# Altium schematic sheet Oscillator.SchDoc
size A4; SheetNumber: 1; SheetTotal: 1
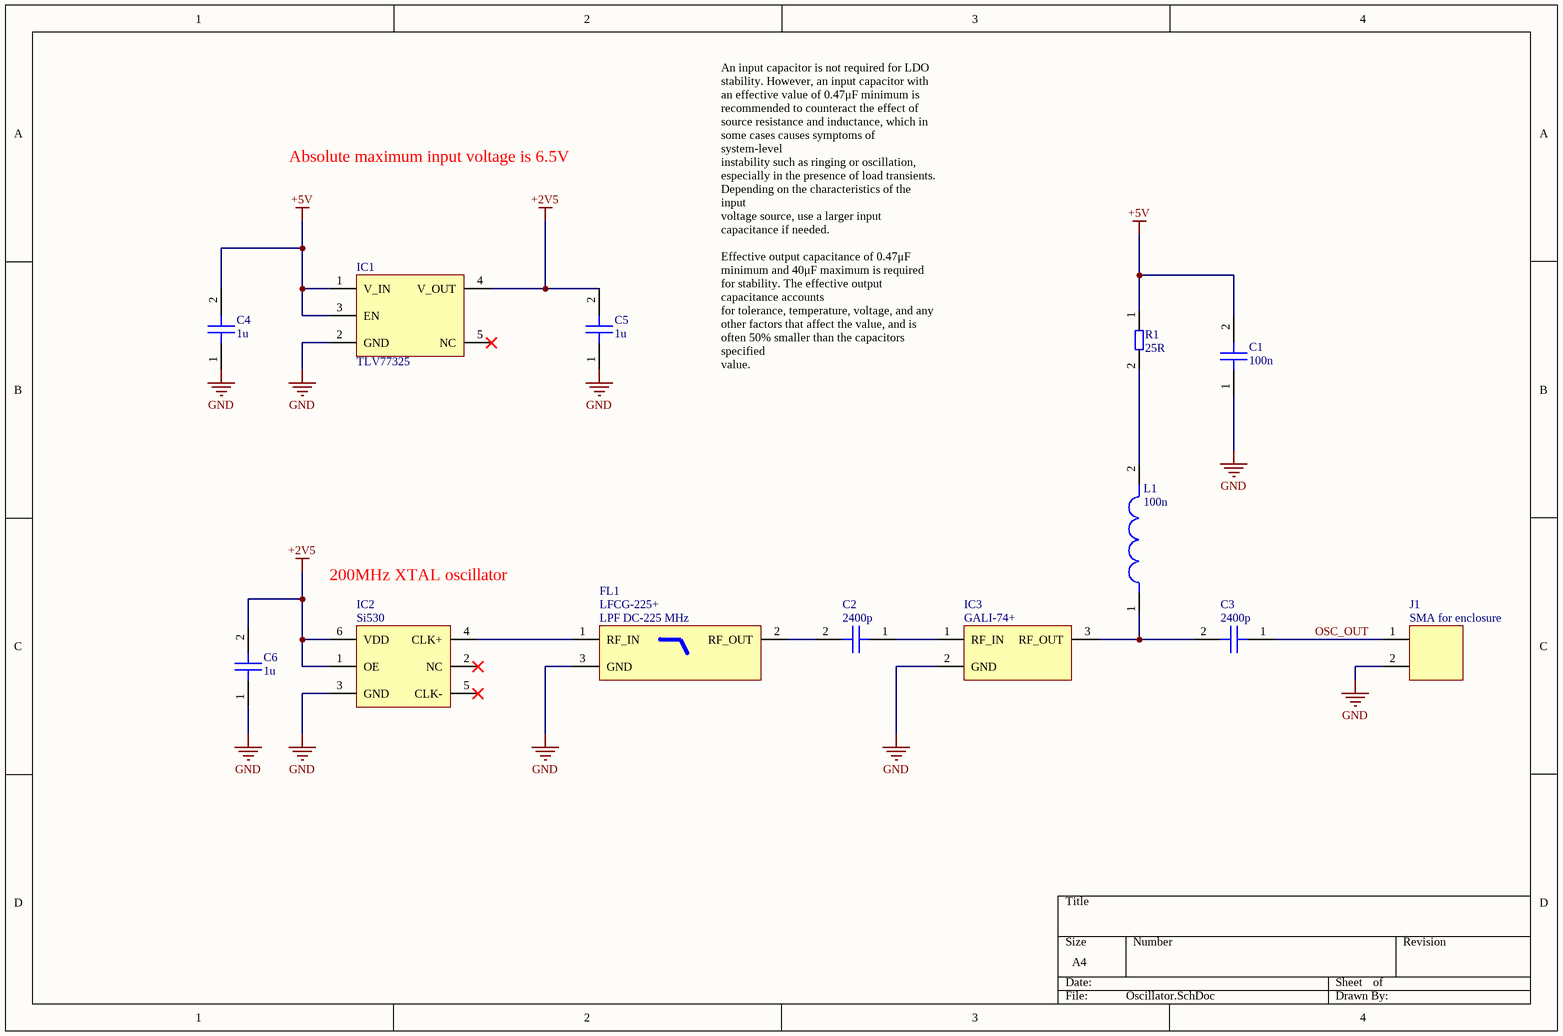
[diagram p0: Oscillator.SchDoc]

## Parts
C1  100n  [0603_CAP]
C2  2400p  [0603_CAP]
C3  2400p  [0603_CAP]
C4  1u  [0603_CAP]
C5  1u  [0603_CAP]
C6  1u  [0603_CAP]
FL1  LFCG-225+
IC1  TLV77325  [IC_TLV77325PDBVR_TEXAS_INSTRUMENTS]
IC2  Si530  [IC_530FC200M000DG]
IC3  GALI-74+  [IC_GALI74+_MINI_CIRCUITS]
J1  SMA for enclosure
L1  100n  [0603_CAP]
R1  25R  [0603_RESISTOR]

## Nets
+2V5: C5.2 C6.2 IC1.4(V_OUT) IC2.1(OE) IC2.6(VDD)
+5V: C1.2 C4.2 IC1.1(V_IN) IC1.3(EN) R1.1
GND: C1.1 C4.1 C5.1 C6.1 FL1.3(GND) IC1.2(GND) IC2.3(GND) IC3.2(GND) J1.2
OSC_OUT: C3.1 J1.1
NetC2_1: C2.1 IC3.1(RF_IN)
NetC2_2: C2.2 FL1.2(RF_OUT)
NetC3_2: C3.2 IC3.3(RF_OUT) L1.1
NetFL1_1: FL1.1(RF_IN) IC2.4(CLK+)
NetL1_2: L1.2 R1.2

Not connected (* = marked no-connect by the designer): IC1 5(NC)*; IC2 2(NC)* 5(CLK-)*

## Notes on the sheet
- Absolute maximum input voltage is 6.5V
- An input capacitor is not required for LDO stability. However, an input capacitor with an effective value of 0.47μF minimum is
  recommended to counteract the effect of source resistance and inductance, which in some cases causes symptoms of system-level
  instability such as ringing or oscillation, especially in the presence of load transients. Depending on the characteristics of the input
  voltage source, use a larger input capacitance if needed.
  Effective output capacitance of 0.47μF minimum and 40μF maximum is required for stability. The effective output capacitance accounts
  for tolerance, temperature, voltage, and any other factors that affect the value, and is often 50% smaller than the capacitors specified
  value.
- 200MHz XTAL oscillator
- (in symbol FL_LFCG-225+_MINI_CIRCUITS) LPF DC-225 MHz

## Library data of the parts
C1-C6 = CAP_0603_generic: Part Number: *; Manufacturer: *; Supplier: *; Order Code: *
  C1: Value: 100n
  C2 C3: Value: 2400p
  C4-C6: Value: 1u
FL1 = FL_LFCG-225+_MINI_CIRCUITS: LFCG-225+ Low Pass Filter
IC1 = IC_TLV77325_TEXAS_INSTRUMENTS: LDO Voltage Regulators 300-mA high-PSRR low -IQ low-dropout regulator
IC2 = IC_SI530_SILICON_LABS: 530FC200M000DG
IC3 = IC_GALI74+_MINI_CIRCUITS: RF Amplifier ML AMPL / SURF MT / RoHS
J1 = HEADER_1x2_0.254MM: Part Number: *; Value: SMA for enclosure; Manufacturer: *; Supplier: *; Order Code: *
L1 = IND_air_0603_generic: Part Number: *; Value: 100n; Manufacturer: *; Supplier: *; Order Code: *
R1 = RES_0603_generic: 3/4W; Part Number: *; Value: 25R; Manufacturer: *; Supplier: *; Order Code: *